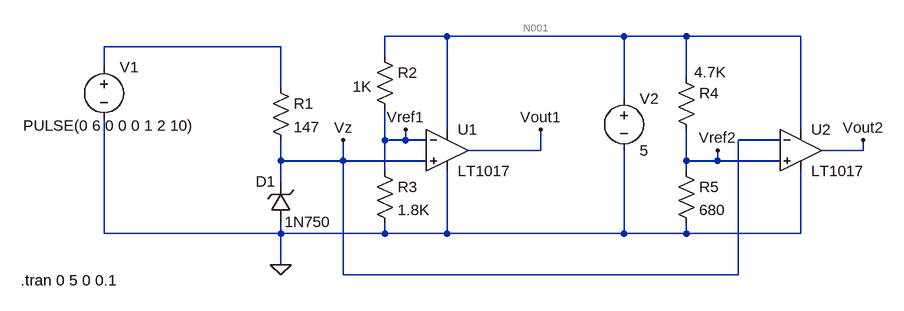
[diagram p0: schematic Zener_diode & Comparator.asc]
Zener_diode & Comparator.asc, the LTspice schematic file:
Version 4
SHEET 1 1412 680
WIRE 576 -16 480 -16
WIRE 848 -16 576 -16
WIRE 944 -16 848 -16
WIRE 1120 -16 944 -16
WIRE 320 0 48 0
WIRE 480 16 480 -16
WIRE 48 32 48 0
WIRE 944 48 944 -16
WIRE 320 64 320 0
WIRE 848 80 848 -16
WIRE 576 128 576 -16
WIRE 1120 128 1120 -16
WIRE 480 144 480 96
WIRE 512 144 512 128
WIRE 512 144 480 144
WIRE 544 144 512 144
WIRE 1088 144 1024 144
WIRE 720 160 720 128
WIRE 720 160 608 160
WIRE 1216 160 1216 144
WIRE 1216 160 1152 160
WIRE 320 176 320 144
WIRE 416 176 416 144
WIRE 416 176 320 176
WIRE 544 176 416 176
WIRE 944 176 944 128
WIRE 992 176 992 160
WIRE 992 176 944 176
WIRE 1088 176 992 176
WIRE 480 192 480 144
WIRE 944 192 944 176
WIRE 320 208 320 176
WIRE 48 288 48 112
WIRE 320 288 320 272
WIRE 320 288 48 288
WIRE 480 288 480 272
WIRE 480 288 320 288
WIRE 576 288 576 192
WIRE 576 288 480 288
WIRE 848 288 848 160
WIRE 848 288 576 288
WIRE 944 288 944 272
WIRE 944 288 848 288
WIRE 1120 288 1120 192
WIRE 1120 288 944 288
WIRE 320 336 320 288
WIRE 416 352 416 176
WIRE 1024 352 1024 144
WIRE 1024 352 416 352
FLAG 320 336 0
FLAG 416 144 Vz
FLAG 512 128 Vref1
FLAG 720 128 Vout1
FLAG 992 160 Vref2
FLAG 1216 144 Vout2
SYMBOL zener 336 272 R180
WINDOW 0 24 64 Left 2
WINDOW 3 -61 2 Left 2
SYMATTR InstName D1
SYMATTR Value 1N750
SYMBOL voltage 48 16 R0
WINDOW 3 -124 106 Left 2
WINDOW 123 0 0 Left 2
WINDOW 39 0 0 Left 2
WINDOW -1 -124 134 Left 2
WINDOW 1 -124 162 Left 2
SYMATTR Value PULSE(0 6 0 0 0 1 2 10)
SYMATTR InstName V1
SYMBOL res 304 48 R0
SYMATTR InstName R1
SYMATTR Value 147
SYMBOL Comparators\\LT1017 576 160 R0
SYMATTR InstName U1
SYMBOL voltage 848 64 R0
SYMATTR InstName V2
SYMATTR Value 5
SYMBOL res 464 0 R0
WINDOW 3 -33 62 Left 2
SYMATTR InstName R2
SYMATTR Value 1K
SYMBOL res 464 176 R0
SYMATTR InstName R3
SYMATTR Value 1.8K
SYMBOL Comparators\\LT1017 1120 160 R0
SYMATTR InstName U2
SYMBOL res 928 32 R0
WINDOW 3 28 7 Left 2
SYMATTR InstName R4
SYMATTR Value 4.7K
SYMBOL res 928 176 R0
SYMATTR InstName R5
SYMATTR Value 680
TEXT -80 360 Left 2 !.tran 0 5 0 0.1

The netlist it stands for:
* Zener_diode & Comparator.asc
D1 0 Vz 1N750
V1 N002 0 PULSE(0 6 0 0 0 1 2 10)
R1 N002 Vz 147
XU1 Vz Vref1 N001 0 Vout1 LT1017  ; pins In+ In- V+ V- OUT
V2 N001 0 5
R2 N001 Vref1 1K
R3 Vref1 0 1.8K
XU2 Vref2 Vz N001 0 Vout2 LT1017  ; pins In+ In- V+ V- OUT
R4 N001 Vref2 4.7K
R5 Vref2 0 680
.model D D
.lib standard.dio
.tran 0 5 0 0.1
.backanno
.end

* Results of the author's LTspice run, read from the files saved beside the schematic
* Operating Point, zero values left out:
*   V(vz) = 882 nV
*   V(n001) = 5 V
*   V(vout1) = 48.4 mV
*   V(vref1) = 3.214 V
*   V(vout2) = 4.96 V
*   V(vref2) = 632 mV
*   I(R5) = 929.4 µA
*   I(R4) = 929.4 µA
*   I(R3) = 1.786 mA
*   I(R2) = 1.786 mA
*   I(R1) = -6 nA
*   I(V2) = -2.944 mA
*   I(V1) = 6 nA
*   Ix(u1:1) = -3 nA
*   Ix(u1:2) = 6.1 nA
*   Ix(u1:3) = 107 µA
*   Ix(u1:4) = -107 µA
*   Ix(u1:5) = 4.912 pA
*   Ix(u2:1) = 3.063 nA
*   Ix(u2:2) = -3 nA
*   Ix(u2:3) = 121.5 µA
*   Ix(u2:4) = -121.5 µA
*   Ix(u2:5) = -4.912 pA
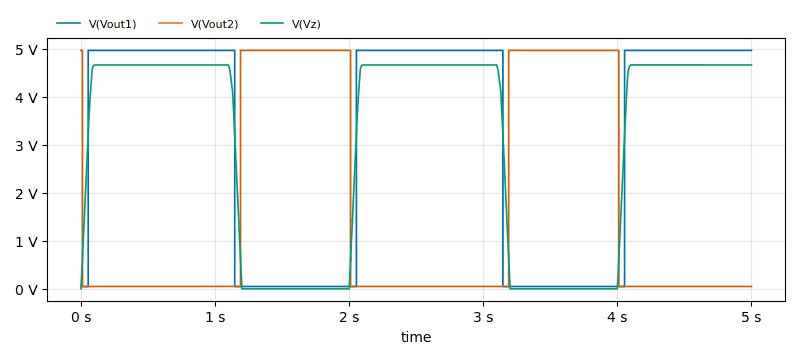
[diagram p1: Transient Analysis of Zener_diode & Comparator.asc, plotted from the saved traces]
* Transient Analysis, 1 run:
*   V(Vout1): min 48.15 mV, max 4.962 V, average 3.125 V, rms 3.926 V, last 4.96 V
*   V(Vout2): min 48.35 mV, max 4.962 V, average 1.672 V, rms 2.852 V, last 48.4 mV
*   V(Vz): min 877.8 nV, max 4.659 V, average 2.982 V, rms 3.687 V, last 4.658 V